# EAGLE design MuroBox-USB (EAGLE 9.6.2)

## Sheet 1 of 3
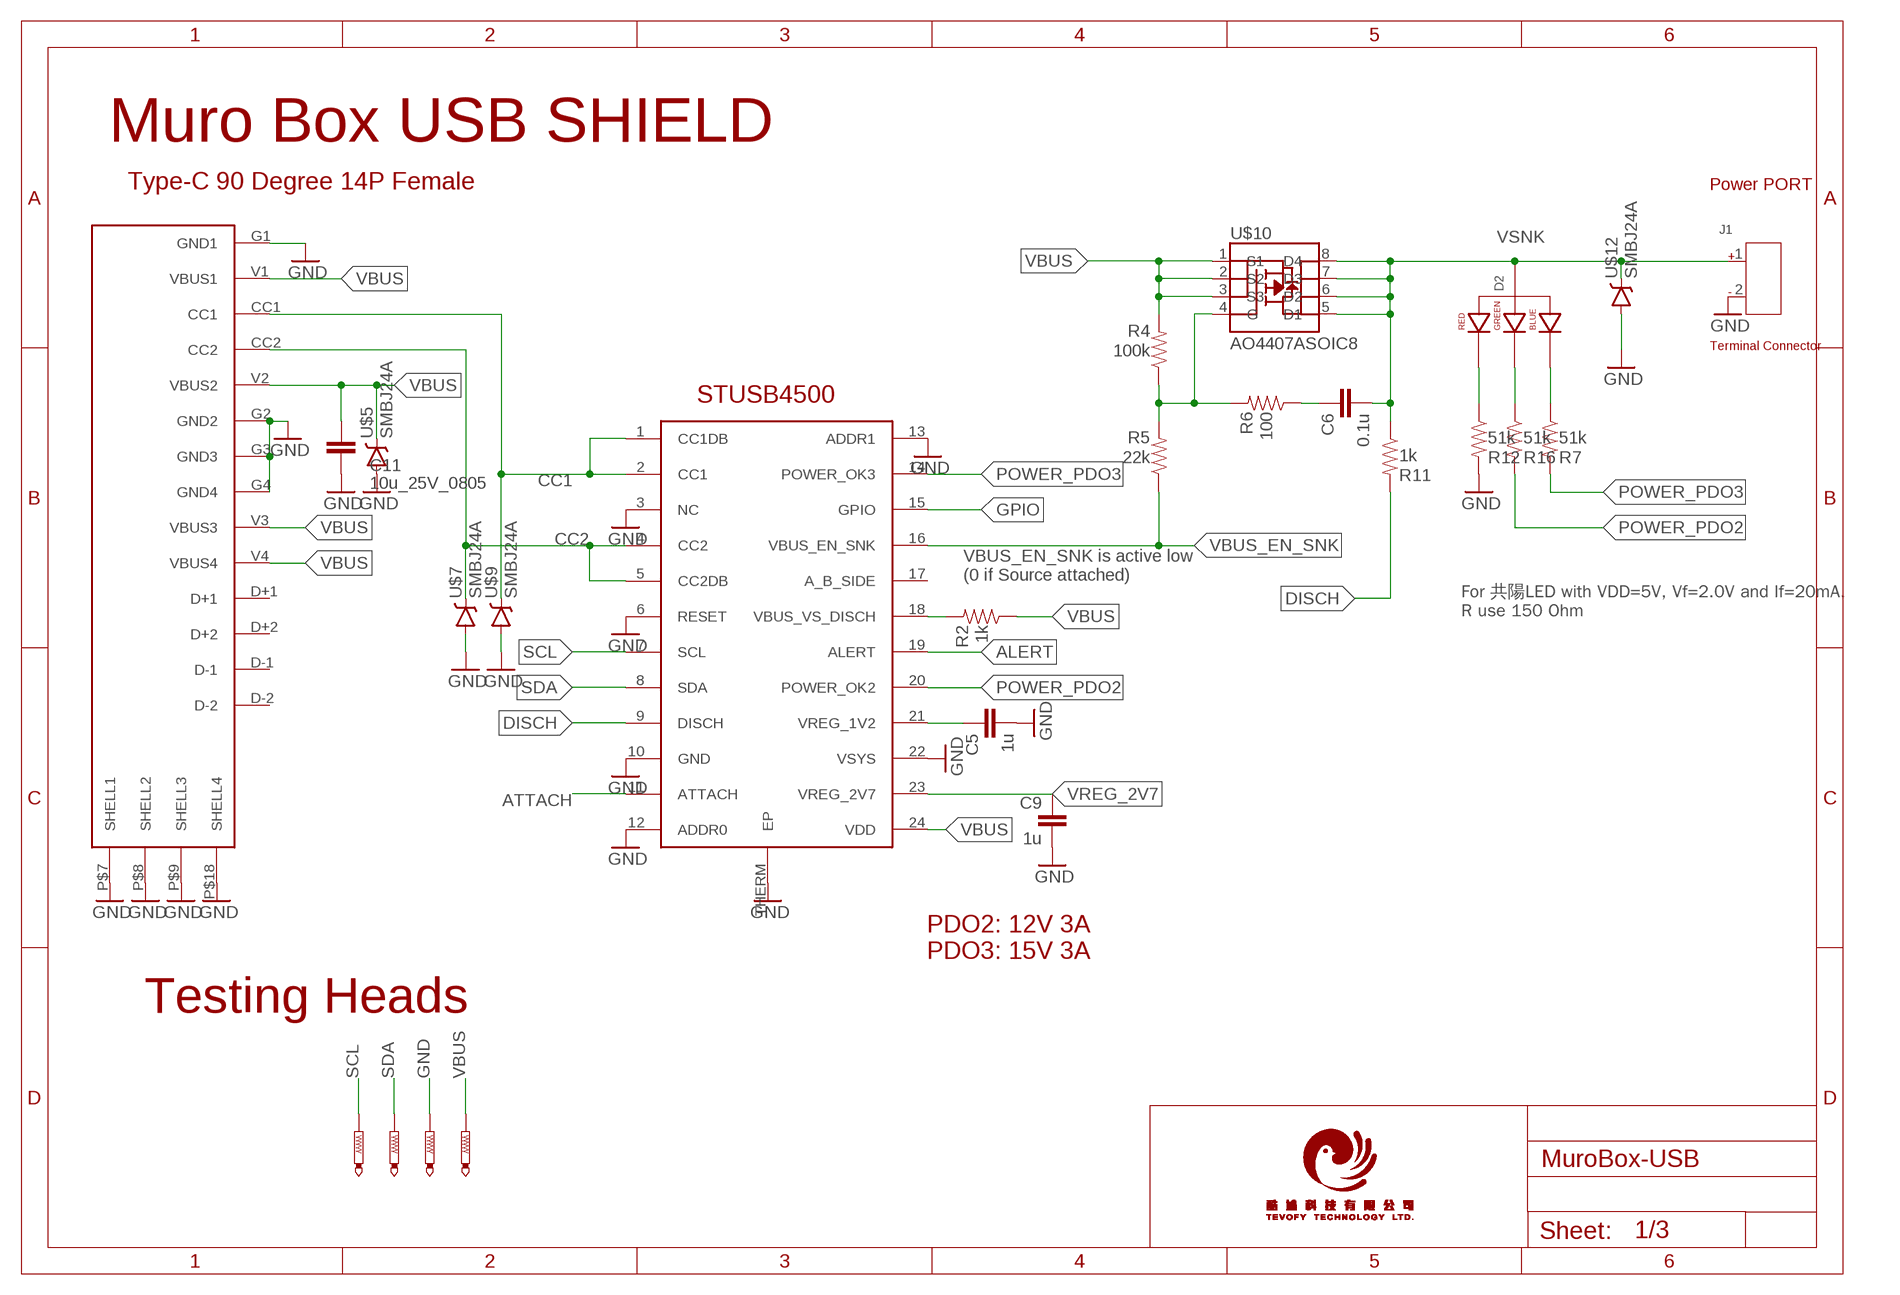
[diagram p0: schematic, sheet 1]

### Parts
C5  1u  CAP0603-CAP  [0603-CAP]
C6  0.1u  CAP0603-CAP  [0603-CAP]
C9  1u  CAP0603-CAP  [0603-CAP]
C11  10u_25V_0805  10UF10V10%(0805)  [0805-CAP]
D2  LED-RGB-CA-THRUCLEAR  [LED-RGB-THRU]
J1  DIP-SCREW-TERMINAL(2P-2.54)  [H2-2.54-5.48X6.3MM]
R2  1k  RESISTOR0603-RES  [0603-RES]
R4  100k  RESISTOR0603-RES  [0603-RES]
R5  22k  RESISTOR0603-RES  [0603-RES]
R6  100  RESISTOR0603-RES  [0603-RES]
R7  51k  RESISTOR0603-RES  [0603-RES]
R11  1k  RESISTOR0603-RES  [0603-RES]
R12  51k  RESISTOR0603-RES  [0603-RES]
R16  51k  RESISTOR0603-RES  [0603-RES]
U$1  STUSB4500  [QFN24]
U$5  SMBJ24A  [SMB-DIODE]
U$7  SMBJ24A  [SMB-DIODE]
U$9  SMBJ24A  [SMB-DIODE]
U$10  AO4407ASOIC8  [SO08]
U$12  SMBJ24A  [SMB-DIODE]
U$22  1PIN_TEST_PAD  [TP18R]
U$23  1PIN_TEST_PAD  [TP18R]
U$25  1PIN_TEST_PAD  [TP18R]
U$26  1PIN_TEST_PAD  [TP18R]
U$27  USB-TYPE-C-90D-12P  [USB-TYPE-C-90D-12P]

### Nets
ALERT: U$1.19(ALERT)
ATTACH: U$1.11(ATTACH)
CC1: U$1.1(CC1DB) U$1.2(CC1) U$9.C U$27.CC1
CC2: U$1.4(CC2) U$1.5(CC2DB) U$7.C U$27.CC2
DISCH: R11.2 U$1.9(DISCH)
GND: C5.1 C9.1 C11.1 J1.2 R12.2 U$1.3(NC) U$1.6(RESET) U$1.10(GND) U$1.12(ADDR0) U$1.13(ADDR1) U$1.22(VSYS) U$1.THERM(EP) U$5.A U$7.A U$9.A U$12.A U$26.TP U$27.G1(GND1) U$27.G2(GND2) U$27.G3(GND3) U$27.G4(GND4) U$27.P$7(SHELL1) U$27.P$8(SHELL2) U$27.P$9(SHELL3) U$27.P$18(SHELL4) ; also sheet 2,3
GPIO: U$1.15(GPIO)
N$3: D2.4(BLUE_CATHODE) R7.1
N$5: R2.2 U$1.18(VBUS_VS_DISCH)
N$8: C5.2 U$1.21(VREG_1V2)
N$9: R4.1 R5.2 R6.2 U$10.4(G)
N$10: C6.2 R6.1
N$12: D2.1(RED_CATHODE) R12.1
N$13: D2.3(GREEN_CATHODE) R16.1
POWER_PDO2: R16.2 U$1.20(POWER_OK2)
POWER_PDO3: R7.2 U$1.14(POWER_OK3)
SCL: U$1.7(SCL) U$23.TP
SDA: U$1.8(SDA) U$22.TP
VBUS: C11.2 R2.1 R4.2 U$1.24(VDD) U$5.C U$10.1(S1) U$10.2(S2) U$10.3(S3) U$25.TP U$27.V1(VBUS1) U$27.V2(VBUS2) U$27.V3(VBUS3) U$27.V4(VBUS4)
VBUS_EN_SNK: R5.1 U$1.16(VBUS_EN_SNK)
VREG_2V7: C9.2 U$1.23(VREG_2V7)
VSNK: C6.1 D2.2(ANODE) J1.1 R11.1 U$10.5(D1) U$10.6(D2) U$10.7(D3) U$10.8(D4) U$12.C
Unconnected: U$1.17(A_B_SIDE) U$27.D+1 U$27.D+2 U$27.D-1 U$27.D-2

### Notes on the sheet
- Muro Box USB SHIELD
- Type-C 90 Degree 14P Female | Power PORT
- Terminal Connector
- STUSB4500
- VBUS_EN_SNK is active low
  (0 if Source attached)
- For 共陽LED with VDD=5V, Vf=2.0V and If=20mA,
  R use 150 Ohm
- PDO2: 12V 3A
  PDO3: 15V 3A
- Testing Heads
- C:/Users/Chen-Hsiang/Hardware/EMB-COOJU/»Ź§°ӼÐ.bmp

## Sheet 2 of 3
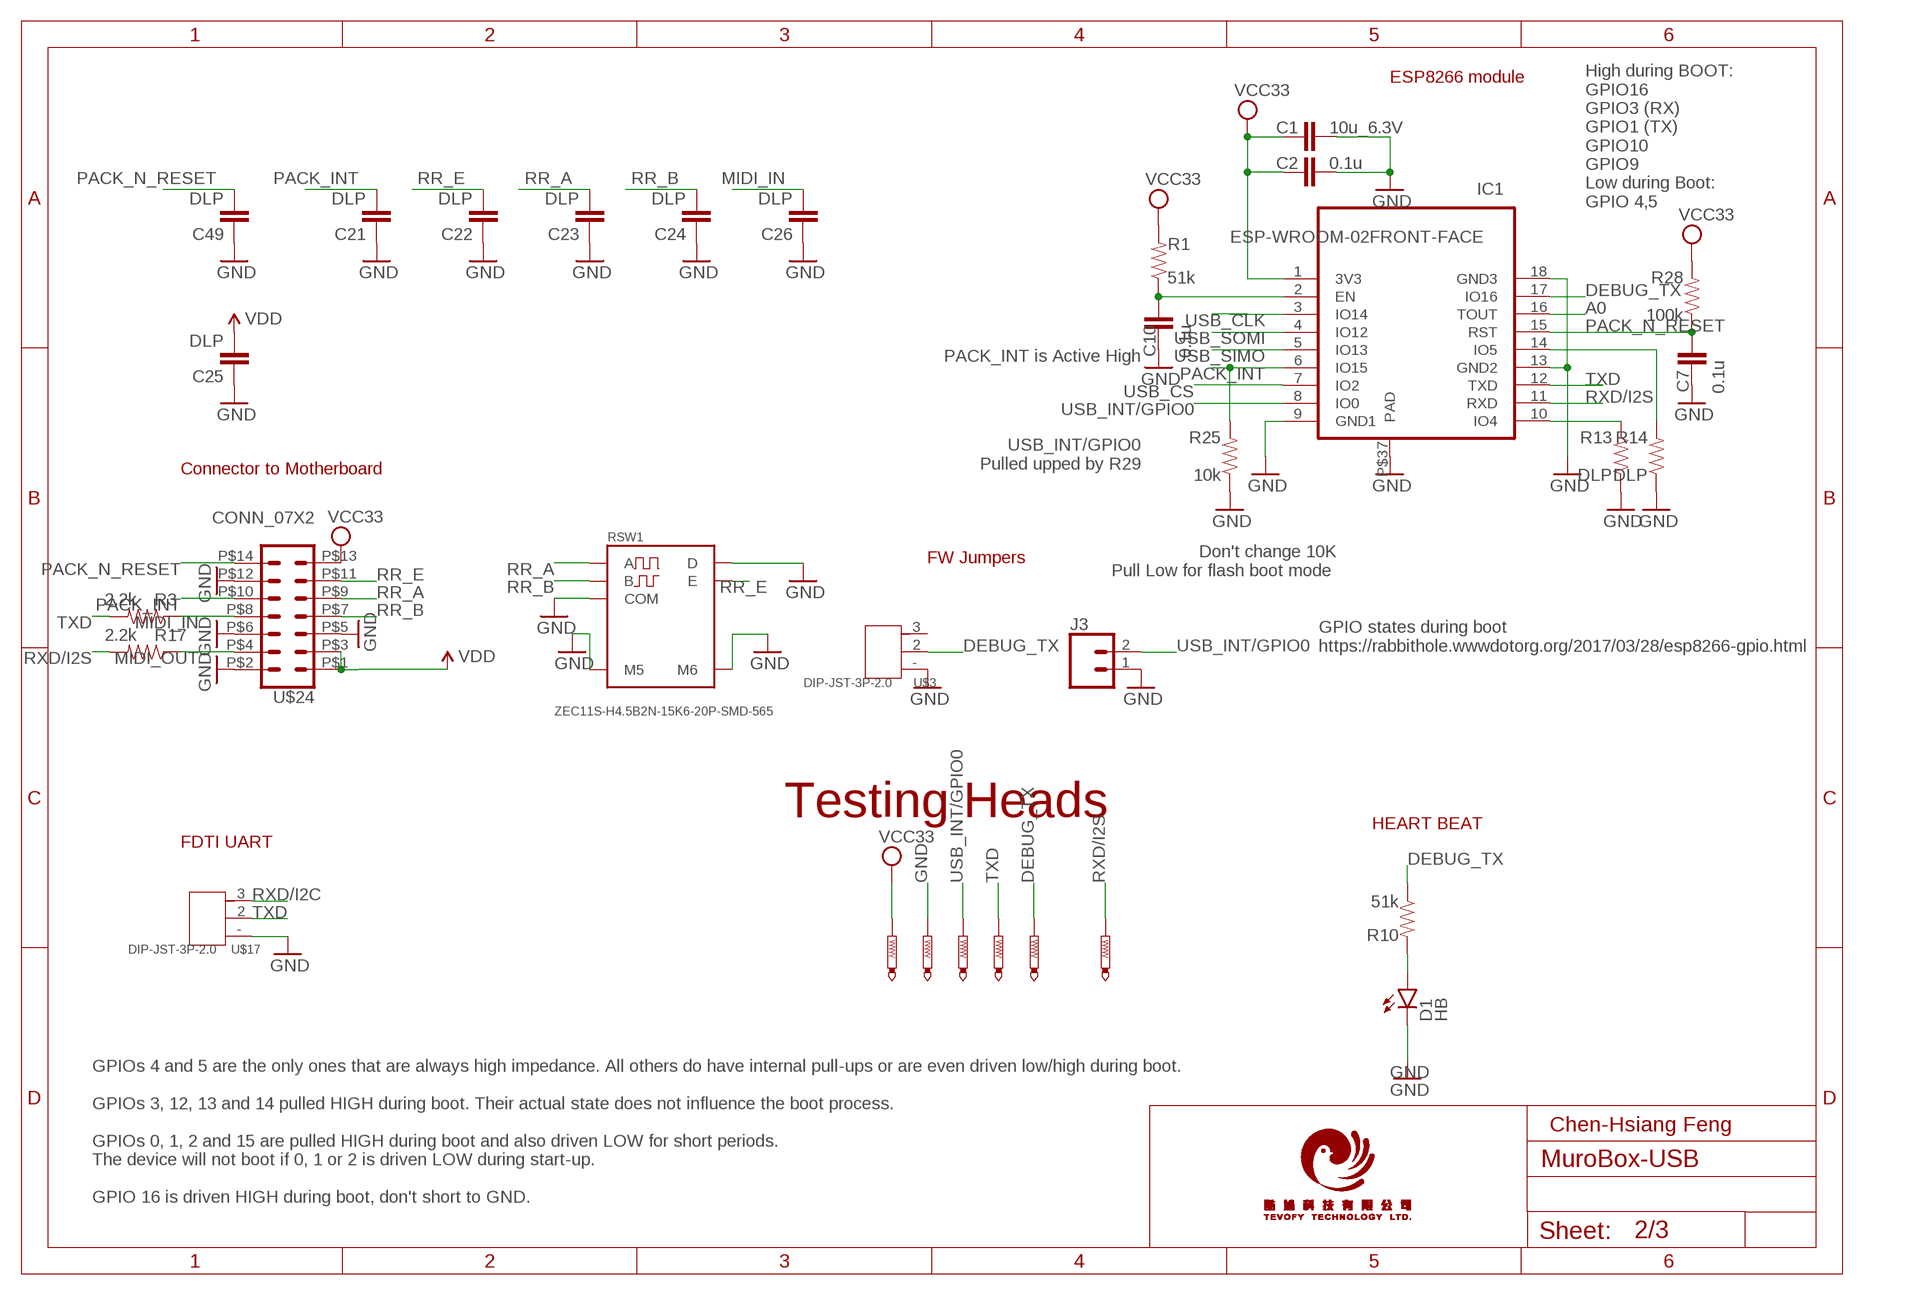
[diagram p1: schematic, sheet 2]

### Parts
C1  10u_6.3V  CAP0603-CAP  [0603-CAP]
C2  0.1u  CAP0603-CAP  [0603-CAP]
C7  0.1u  CAP0603-CAP  [0603-CAP]
C10  0.1u  CAP0603-CAP  [0603-CAP]
C21  DLP  CAP0603-CAP  [0603-CAP]
C22  DLP  CAP0603-CAP  [0603-CAP]
C23  DLP  CAP0603-CAP  [0603-CAP]
C24  DLP  CAP0603-CAP  [0603-CAP]
C25  DLP  CAP0603-CAP  [0603-CAP]
C26  DLP  CAP0603-CAP  [0603-CAP]
C49  DLP  CAP0603-CAP  [0603-CAP]
D1  HB  LED-RED0603  [LED-0603]
IC1  ESP-WROOM-02FRONT-FACE  [ESP-WROOM-02_FRONT-FACE]
J3  CONN_02LOCK  [1X02_LOCK]
R1  51k  RESISTOR0603-RES  [0603-RES]
R3  2.2k  RESISTOR0603-RES  [0603-RES]
R10  51k  RESISTOR0603-RES  [0603-RES]
R13  DLP  RESISTOR0603-RES  [0603-RES]
R14  DLP  RESISTOR0603-RES  [0603-RES]
R17  2.2k  RESISTOR0603-RES  [0603-RES]
R25  10k  RESISTOR0603-RES  [0603-RES]
R28  100k  RESISTOR0603-RES  [0603-RES]
RSW1  ZEC11S-H4.5B2N-15K6-20P-SMD-565  SW-EC11-CHINA  [EC11-CHINA]
U$3  DIP-JST-3P-2.0  [H3-2.0-8X4.5MM]
U$4  1PIN_TEST_PAD  [TP18R]
U$8  1PIN_TEST_PAD  [TP18R]
U$14  1PIN_TEST_PAD  [TP18R]
U$16  1PIN_TEST_PAD  [TP18R]
U$17  DIP-JST-3P-2.0  [H3-2.0-8X4.5MM]
U$18  1PIN_TEST_PAD  [TP18R]
U$19  1PIN_TEST_PAD  [TP18R]
U$24  CONN_07X2  [PHB-7X2]

### Nets
A0: IC1.16(TOUT)
DEBUG_TX: IC1.17(IO16) R10.1 U$3.2 U$4.TP
EN: C10.2 IC1.2(EN) R1.1
GND: C1.2 C2.2 C7.1 C10.1 C21.1 C22.1 C23.1 C24.1 C25.1 C26.1 C49.1 D1.C IC1.9(GND1) IC1.13(GND2) IC1.18(GND3) IC1.P$37(PAD) J3.1 R13.1 R14.1 R25.1 RSW1.C(COM) RSW1.M5 RSW1.M6 RSW1.SW1(D) U$3.- U$17.- U$18.TP U$24.P$2 U$24.P$5 U$24.P$6 U$24.P$12 ; also sheet 1,3
MIDI_IN: C26.2 R3.1 U$24.P$8
MIDI_OUT: R17.1 U$24.P$4
N$11: D1.A R10.2
N$14: IC1.10(IO4) R13.2
N$19: IC1.14(IO5) R14.2
PACK_INT: C21.2 IC1.6(IO15) R25.2 U$24.P$10
PACK_N_RESET: C7.2 C49.2 IC1.15(RST) R28.1 U$24.P$14 ; also sheet 3
RR_A: C23.2 RSW1.A U$24.P$9
RR_B: C24.2 RSW1.B U$24.P$7
RR_E: C22.2 RSW1.SW2(E) U$24.P$11
RXD/I2C: U$17.3
RXD/I2S: IC1.11(RXD) R17.2 U$14.TP
TXD: IC1.12(TXD) R3.2 U$8.TP U$17.2
USB_CLK: IC1.3(IO14) ; also sheet 3
USB_CS: IC1.7(IO2) ; also sheet 3
USB_INT/GPIO0: IC1.8(IO0) J3.2 U$16.TP ; also sheet 3
USB_SIMO: IC1.5(IO13) ; also sheet 3
USB_SOMI: IC1.4(IO12) ; also sheet 3
VCC: C1.1 C2.1 IC1.1(3V3) R1.2 R28.2 U$19.TP U$24.P$13 ; supply symbol labelled VCC33 ; also sheet 3
VDD: C25.2 U$24.P$1 U$24.P$3 ; also sheet 3
Unconnected: U$3.3

### Notes on the sheet
- ESP8266 module
- High during BOOT:
  GPIO16
  GPIO3 (RX)
  GPIO1 (TX)
  GPIO10
  GPIO9
  Low during Boot:
  GPIO 4,5
- PACK_INT is Active High
- USB_INT/GPIO0
  Pulled upped by R29
- Connector to Motherboard
- Don't change 10K
  Pull Low for flash boot mode
- FW Jumpers
- GPIO states during boot
  https://rabbithole.wwwdotorg.org/2017/03/28/esp8266-gpio.html
- Testing Heads
- HEART BEAT
- FDTI UART
- Chen-Hsiang Feng
- GPIOs 4 and 5 are the only ones that are always high impedance. All others do have internal pull-ups or are even driven low/high during boot.
  
  GPIOs 3, 12, 13 and 14 pulled HIGH during boot. Their actual state does not influence the boot process.
  
  GPIOs 0, 1, 2 and 15 are pulled HIGH during boot and also driven LOW for short periods. 
  The device will not boot if 0, 1 or 2 is driven LOW during start-up.
  
  GPIO 16 is driven HIGH during boot, don't short to GND.
- C:/Users/Chen-Hsiang/Hardware/EMB-COOJU/»Ź§°ӼÐ.bmp

## Sheet 3 of 3
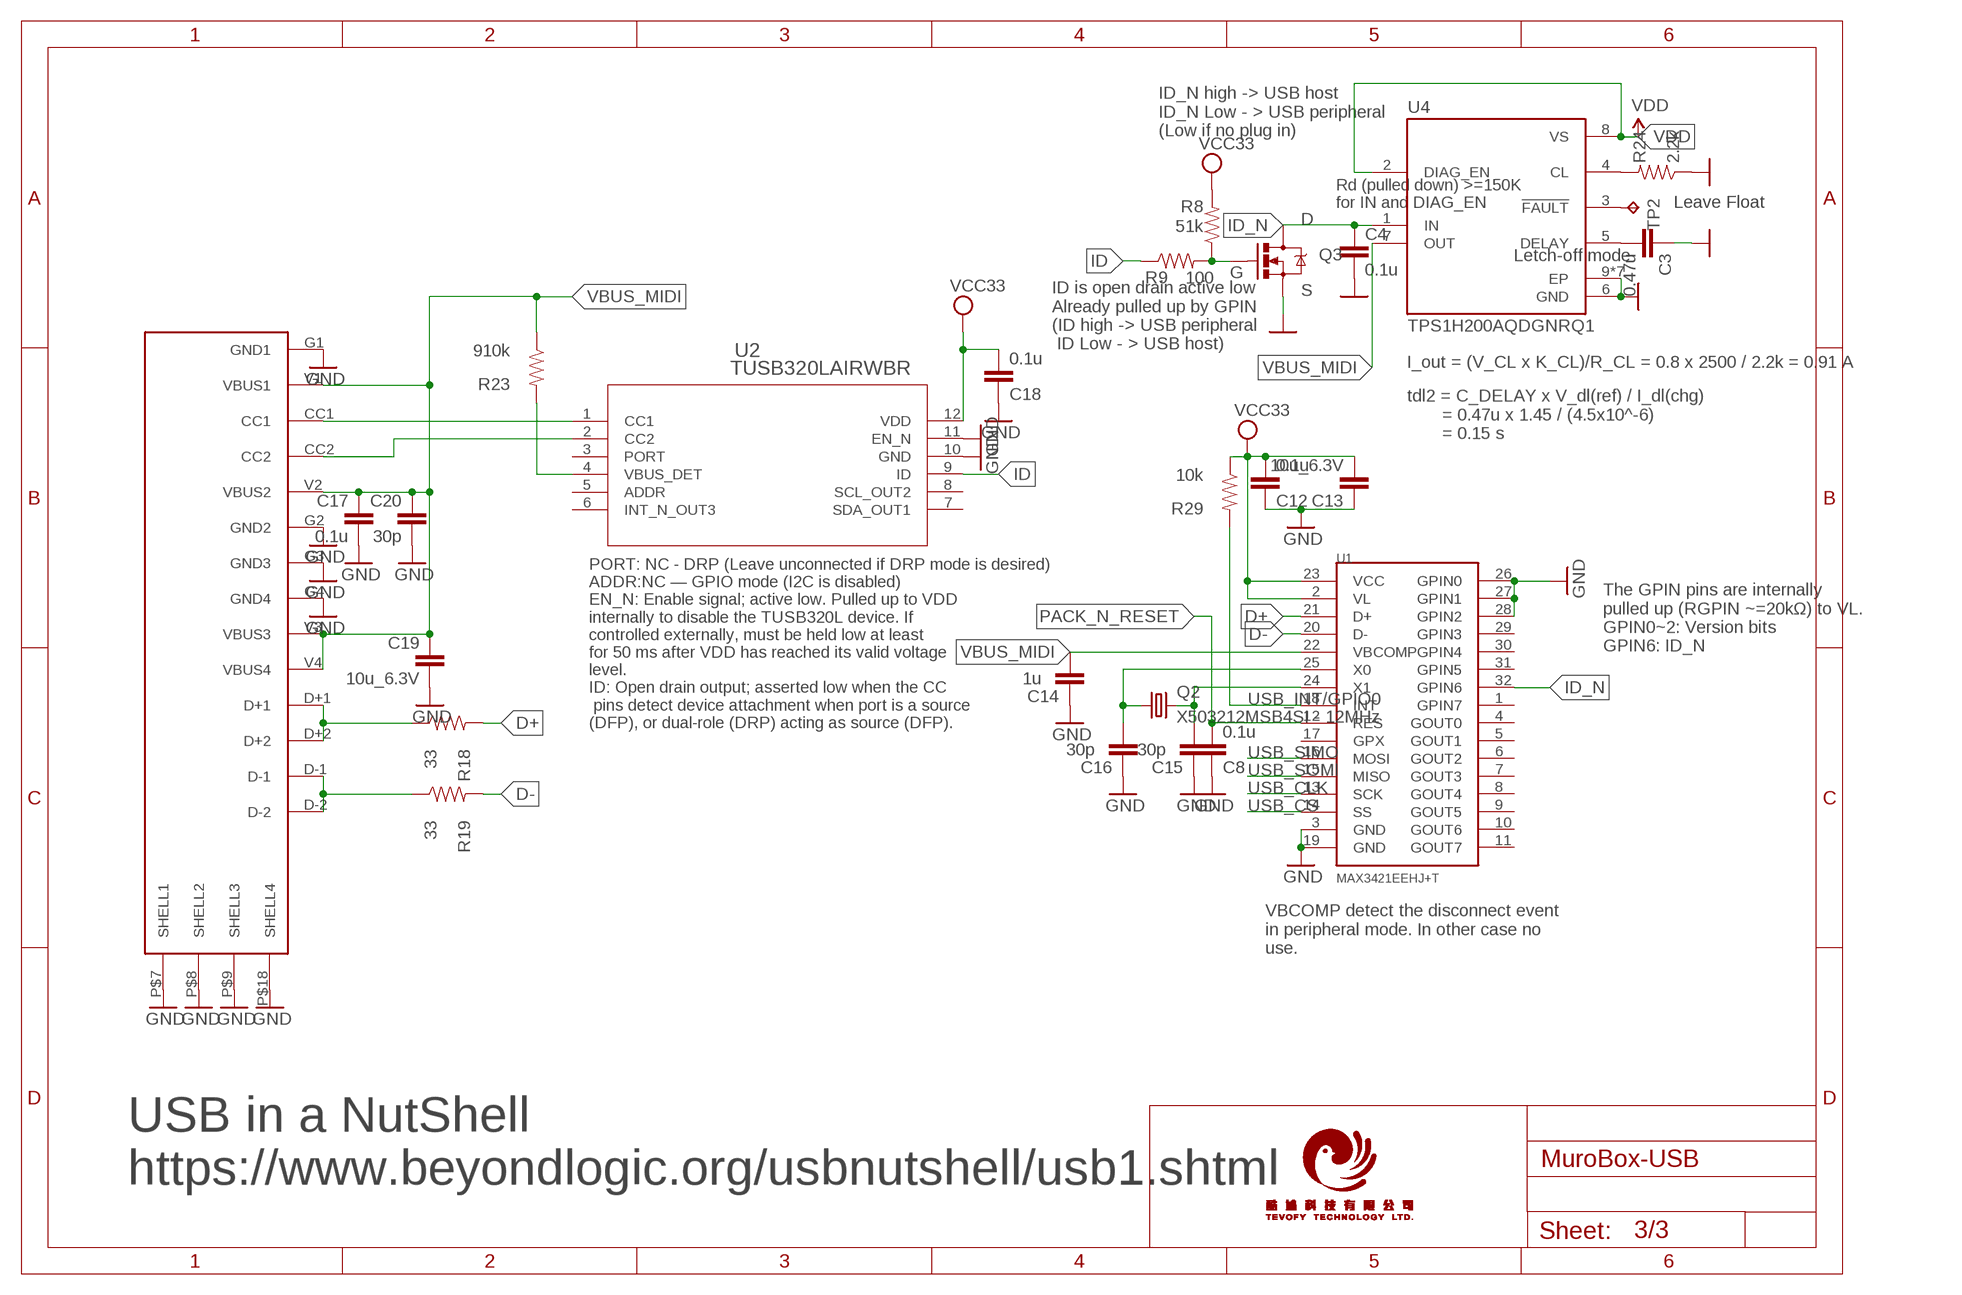
[diagram p2: schematic, sheet 3]

### Parts
C3  0.47u  CAP0603-CAP  [0603-CAP]
C4  0.1u  CAP0603-CAP  [0603-CAP]
C8  0.1u  CAP0603-CAP  [0603-CAP]
C12  0.1u  CAP0603-CAP  [0603-CAP]
C13  10u_6.3V  CAP0603-CAP  [0603-CAP]
C14  1u  CAP0603-CAP  [0603-CAP]
C15  30p  CAP0603-CAP  [0603-CAP]
C16  30p  CAP0603-CAP  [0603-CAP]
C17  0.1u  CAP0603-CAP  [0603-CAP]
C18  0.1u  CAP0603-CAP  [0603-CAP]
C19  10u_6.3V  CAP0603-CAP  [0603-CAP]
C20  30p  CAP0603-CAP  [0603-CAP]
Q2  X503212MSB4SI - 12MHz  CRYSTAL5X3  [CRYSTAL-SMD-5X3]
Q3  AO3400A_X0RB48  AO3400A_X0RB48SOT23  [SOT23]
R8  51k  RESISTOR0603-RES  [0603-RES]
R9  100  RESISTOR0603-RES  [0603-RES]
R18  33  RESISTOR0603-RES  [0603-RES]
R19  33  RESISTOR0603-RES  [0603-RES]
R23  910k  RESISTOR0603-RES  [0603-RES]
R24  2.2k  RESISTOR0603-RES  [0603-RES]
R29  10k  RESISTOR0603-RES  [0603-RES]
TP2  TPB1,27  [B1,27]
U1  MAX3421EEHJ+T  MAX3421ESMD  [TQFP32-5MM]
U2  TUSB320LAIRWBR  [RWB0012A_TEX]
U4  TPS1H200AQDGNRQ1  [SOP65P490X110-9N]
U$6  USB-TYPE-C-90D-12P  [USB-TYPE-C-90D-12P]

### Nets
D+: R18.2 U1.21(D+)
D-: R19.2 U1.20(D-)
GND: C3.1 C4.2 C8.1 C12.1 C13.1 C14.1 C15.1 C16.1 C17.1 C18.1 C19.1 C20.1 Q3.2(S) R24.1 U1.3(GND) U1.19(GND) U1.26(GPIN0) U1.27(GPIN1) U1.28(GPIN2) U2.10(GND) U2.11(EN_N) U4.6(GND) U4.9(EP) U4.9_1(EP) U4.9_2(EP) U4.9_3(EP) U4.9_4(EP) U4.9_5(EP) U4.9_6(EP) U$6.G1(GND1) U$6.G2(GND2) U$6.G3(GND3) U$6.G4(GND4) U$6.P$7(SHELL1) U$6.P$8(SHELL2) U$6.P$9(SHELL3) U$6.P$18(SHELL4) ; supply symbol labelled SUPPLY1_GND ; also sheet 1,2
ID: R9.1 U2.9(ID)
ID_N: C4.1 Q3.3(D) U1.32(GPIN6) U4.1(IN)
N$2: TP2.TP U4.3(!FAULT)
N$15: R24.2 U4.4(CL)
N$16: C3.2 U4.5(DELAY)
N$17: R18.1 U$6.D+1 U$6.D+2
N$18: R19.1 U$6.D-1 U$6.D-2
N$20: C16.2 Q2.1 U1.25(X0)
N$21: C15.2 Q2.3 U1.24(X1)
N$25: U2.1(CC1) U$6.CC1
N$26: U2.2(CC2) U$6.CC2
N$27: R23.2 U2.4(VBUS_DET)
N$28: Q3.1(G) R8.1 R9.2
PACK_N_RESET: C8.2 U1.12(RES) ; also sheet 2
USB_CLK: U1.13(SCK) ; also sheet 2
USB_CS: U1.14(SS) ; also sheet 2
USB_INT/GPIO0: R29.2 U1.18(INT) ; also sheet 2
USB_SIMO: U1.16(MOSI) ; also sheet 2
USB_SOMI: U1.15(MISO) ; also sheet 2
VBUS_MIDI: C14.2 C17.2 C19.2 C20.2 R23.1 U1.22(VBCOMP) U4.7(OUT) U$6.V1(VBUS1) U$6.V2(VBUS2) U$6.V3(VBUS3) U$6.V4(VBUS4)
VCC: C12.2 C13.2 C18.2 R8.2 R29.1 U1.2(VL) U1.23(VCC) U2.12(VDD) ; supply symbol labelled VCC33 ; also sheet 2
VDD: U4.2(DIAG_EN) U4.8(VS) ; also sheet 2
Unconnected: U1.1(GPIN7) U1.4(GOUT0) U1.5(GOUT1) U1.6(GOUT2) U1.7(GOUT3) U1.8(GOUT4) U1.9(GOUT5) U1.10(GOUT6) U1.11(GOUT7) U1.17(GPX) U1.29(GPIN3) U1.30(GPIN4) U1.31(GPIN5) U2.3(PORT) U2.5(ADDR) U2.6(INT_N_OUT3) U2.7(SDA_OUT1) U2.8(SCL_OUT2)

### Notes on the sheet
- ID_N high -> USB host
  ID_N Low - > USB peripheral
  (Low if no plug in)
- Rd (pulled down) >=150K
  for IN and DIAG_EN
- Leave Float
- D
- Letch-off mode
- G
- S
- ID is open drain active low
  Already pulled up by GPIN
  (ID high -> USB peripheral
   ID Low - > USB host)
- I_out = (V_CL x K_CL)/R_CL = 0.8 x 2500 / 2.2k = 0.91 A
- tdl2 = C_DELAY x V_dl(ref) / I_dl(chg)
         = 0.47u x 1.45 / (4.5x10^-6)
         = 0.15 s
- The GPIN pins are internally
  pulled up (RGPIN ~=20kΩ) to VL.
  GPIN0~2: Version bits
  GPIN6: ID_N
- PORT: NC - DRP (Leave unconnected if DRP mode is desired)
  ADDR:NC — GPIO mode (I2C is disabled)
  EN_N: Enable signal; active low. Pulled up to VDD
  internally to disable the TUSB320L device. If 
  controlled externally, must be held low at least 
  for 50 ms after VDD has reached its valid voltage
  level.
  ID: Open drain output; asserted low when the CC
   pins detect device attachment when port is a source 
  (DFP), or dual-role (DRP) acting as source (DFP).
- VBCOMP detect the disconnect event
  in peripheral mode. In other case no
  use.
- USB in a NutShell
  https://www.beyondlogic.org/usbnutshell/usb1.shtml
- C:/Users/Chen-Hsiang/Hardware/EMB-COOJU/»Ź§°ӼÐ.bmp

## Library data of the parts
C1-C10 C12-C26 C49 = SparkFun-Passives:CAP: Capacitor Standard 0603 ceramic capacitor, and 0.1" leaded capacitor.
C11 = SparkFun-Capacitors:10UF10V10%(0805): CAP-11330; PROD_ID: CAP-11330
D1 = SparkFun-LED:LED-RED: Assorted Red LEDs LilyPad 1206- DIO-09912 1206- DIO-00809 0603- DIO-00819 "SMART" means more efficient and expensive; PROD_ID: DIO-00819; VALUE: RED
D2 = SparkFun-LED:LED-RGB-CA-THRU: RGB Through-hole common anode SparkFun store front COM-10821 (diffuse) COM-10820 (clear); PROD_ID: DIO-10631
IC1 = music_box:ESP-WROOM-02: WiFi module - ESP-WROOM-02; PART_NUMBER: ESP-WROOM-02; SUPPLIER: espressif
J1 = music_box:DIP-SCREW-TERMINAL(2P-2.54): 320110133
J3 = SparkFun-Connectors:CONN_02: Multi connection point. Often used as Generic Header-pin footprint for 0.1 inch spaced/style header connections On any of the 0.1 inch spaced packages, you can populate with these: Break Away Headers - Straight <https://www.sparkfun.com/products/116> (PRT-00116) Break Away Male Headers - Right Angle <https://www.sparkfun.com/products/553> (PRT-00553) Female Headers <https://www.sparkfun.com/products/115> (PRT-00115) Break Away Headers - Machine Pin <https://www.sparkfun.com/products/117> (PRT-00117) Break Away Female Headers - Swiss Machine Pin <https://www.sparkfun.com/products/743> (PRT-00743) For SCREWTERMINALS and SPRING TERMINALS visit here: Screw Terimnals on SparkFun.com <https://www.sparkfun.com/search/results?term=Screw+Terminals> (5mm/3.5mm/2.54mm spacing) This device is also useful as a general connection point to wire up your design to another part of your project. Our various solder wires solder well into these plated through hole pads. Hook-Up Wire - Assortment (Stranded, 22 AWG) <https://www.sparkfun.com/products/11375> (PRT-11375) Hook-Up Wire - Assortment (Solid Core, 22 AWG) <https://www.sparkfun.com/products/11367> (PRT-11367) View the entire wire category on our website here <https://www.sparkfun.com/categories/141> Special notes: Molex polarized connector foot print use with: PRT-08233 with associated crimp pins and housings. 2.54_SCREWTERM for use with PRT-10571. 3.5mm Screw Terminal footprints for PRT-08084 5mm Screw Terminal footprints for use with PRT-08432
Q2 = USBHostShield-v13:CRYSTAL: Crystals Various standard crystals. Proven footprints. Spark Fun Electronics SKU : COM-00534
Q3 = music_box:AO3400A_X0RB48: MOSFET
R1-R14 R16-R19 R23-R25 R28 R29 = SparkFun-Passives:RESISTOR: Resistor Basic schematic elements and footprints for 0603, 1206, and PTH resistors.
RSW1 = music_box:SW-EC11-CHINA: 大陸廠排 https://detail.1688.com/offer/530151855898.html?spm=a2615.7691456.autotrace-offerGeneral.13.40d64726QFa8QW
TP2 = testpad:TP: Test pad
U1 = USBHostShield-v13:MAX3421E: USB Peripheral/Host Controller w/ SPI
U2 = TUSB320LAIRWBR:TUSB320LAIRWBR; BUILT_BY: EMA_UL_Team; COPYRIGHT: Copyright (C) 2018 Accelerated Designs. All rights reserved; MANUFACTURER_PART_NUMBER: TUSB320LAIRWBR; SOURCELIBRARY: TI_2019-03-28; VENDOR: Texas Instruments
U4 = TPS1H200AQDGNRQ1:TPS1H200AQDGNRQ1: Power Switch/Driver 1:1 N-Channel 2.5A 8-MSOP-PowerPad; AVAILABILITY: Unavailable; DESCRIPTION: Power Switch/Driver 1:1 N-Channel 2.5A 8-MSOP-PowerPad; MF: Texas Instruments; MP: TPS1H200AQDGNRQ1; PACKAGE: MSOP-8 Texas Instruments; PRICE: None
U$1 = music_box:STUSB4500: STUSB4500： Standalone USB PD sink controller with short-to-VBUS protections
U$3 U$17 = music_box:DIP-JST-3P-2.0
U$4 U$8 U$14 U$16 U$18 U$19 U$22 U$23 U$25 U$26 = music_box:1PIN_TEST_PAD
U$5 U$7 U$9 U$12 = music_box:SMBJ24A: TVS贴片瞬态抑制二极管 SMBJ12A-E3/52 600W 12V ==== https://item.taobao.com/item.htm?spm=a1z0d.7625083.1998302264.5.686c4e69JiVgEf&id=522552831489
U$6 U$27 = music_box:USB-TYPE-C-90D-12P: USB type-c 12p 直立式 smd 淘寶買的 https://item.taobao.com/item.htm?spm=a1z09.2.0.0.2abf2e8d68dfN7&id=554675207939&_u=72nkl8u2d455
U$10 = music_box:AO4407A: AO4407A 30V P-Channel MOSFET
U$24 = music_box:CONN_07X2

## Board
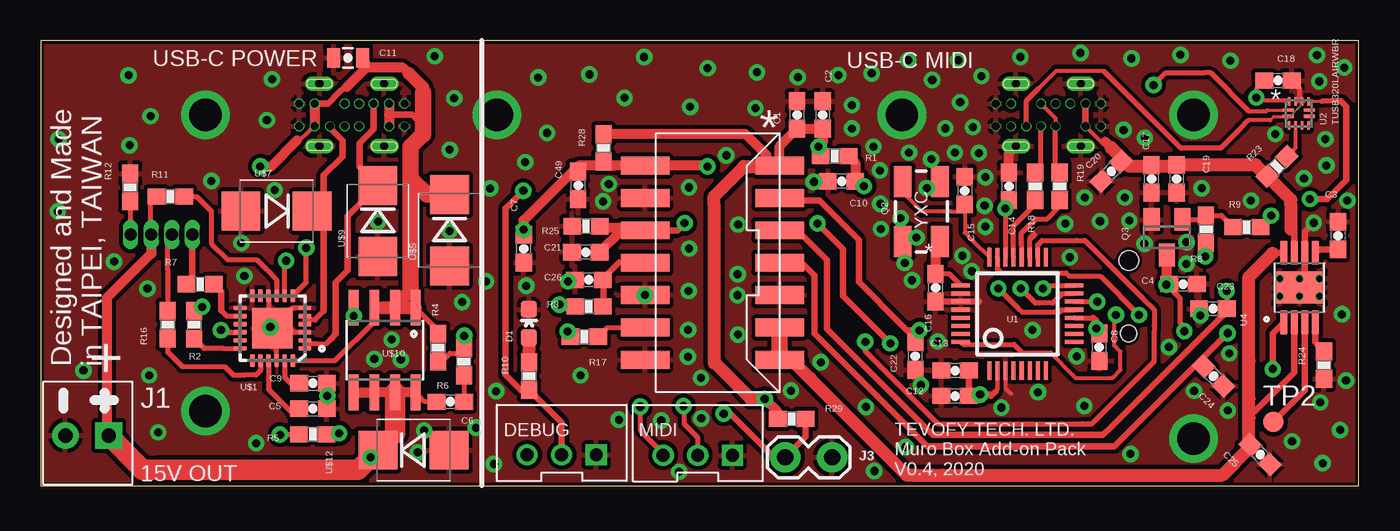
[diagram p3: board, top side]
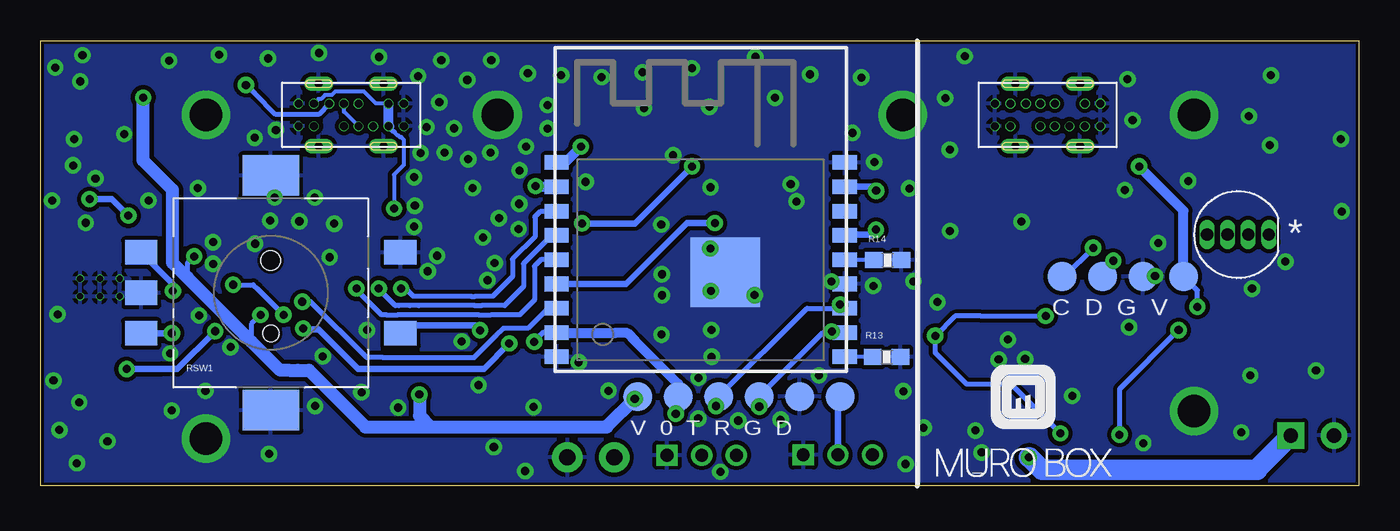
[diagram p4: board, bottom side, seen from below]

Size 81.4 x 27.5 mm. Coordinates in mm from the lower left corner, seen from the top.
Outline: 0,0 81.4,0
Outline: 0,27.5 0,0
Outline: 81.4,27.5 0,27.5
Outline: 81.4,0 81.4,27.5
Outline: 0,27.5 0,0
Outline: 0,0 81.4,0
Outline: 81.4,27.5 0,27.5
Outline: 81.4,0 81.4,27.5
Copper layers (1*16): Top 0.035mm / dielectric 1.5mm / Bottom 0.035mm
Design rules "SparkFun-2-layer *": minimum track width 10mil, minimum drill 20mil, track to track 10mil, track to pad 8mil, pad to pad 8mil, via to via 10mil, smd to smd 8mil, copper to edge 8mil, drill to drill 8mil, minimum pad ring 1mil, minimum via ring 10mil, stop-mask expansion 4mil, vias tented up to drill 20mil, thermal gap 10mil

### Footprints (pad centres in the part's own frame; a part is rotated, then mirrored left to right if it is on the bottom)
0603-CAP = smd 1.1 x 1: 1 -0.85,0; 2 0.85,0
0805-CAP = smd 0.8 x 1.2: 1 -0.9,0; 2 0.9,0
LED-0603 = smd 1 x 1: A 0,-0.877; C 0,0.877
LED-RGB-THRU = drill 0.762 pad 0.889 long: 1 1.905,0; 2 0.635,0; 3 -0.635,0; 4 -1.905,0
ESP-WROOM-02_FRONT-FACE = smd 1.485 x 0.9: 1 -8.893,4.9; 2 -8.893,3.4; 3 -8.893,1.9; 4 -8.893,0.4; 5 -8.893,-1.1; 6 -8.893,-2.6; 7 -8.893,-4.1; 8 -8.893,-5.6; 9 -8.893,-7.1; 10 8.893,-7.1; 11 8.893,-5.6; 12 8.893,-4.1; 13 8.893,-2.6; 14 8.893,-1.1; 15 8.893,0.4; 16 8.893,1.9; 17 8.893,3.4; 18 8.893,4.9 | smd 4.3 x 4.3: P$37 1.524,-1.878
H2-2.54-5.48X6.3MM = drill 0.889 pad 1.651 square: 1 3.3,4.064 | drill 0.889 pad 1.651: 2 3.3,1.397
1X02_LOCK = drill 1.016 pad 1.88: 1 -0.178,0; 2 2.718,0
CRYSTAL-SMD-5X3 = smd 1.9 x 1.1: 1 -1.85,-1.15; 2 1.85,-1.15; 3 1.85,1.15; 4 -1.85,1.15
SOT23 = smd 1 x 1.4: 1 -0.95,-1.1; 2 0.95,-1.1; 3 0,1.1
0603-RES = smd 1.1 x 1: 1 -0.85,0; 2 0.85,0
EC11-CHINA = smd 1.5 x 2: A -2.5,-8; B 2.5,-8; C 0,-8; SW1 -2.5,8; SW2 2.5,8 | smd 2.5 x 3.5: M5 -7.25,0; M6 7.25,0 | hole 1.2: -2,0 | hole 1: 2.5,0
B1,27 = smd 1.27 x 1.27: TP 0,0
TQFP32-5MM = smd 1.143 x 0.254: 1 -3.5,1.75; 2 -3.5,1.25; 3 -3.5,0.75; 4 -3.5,0.25; 5 -3.5,-0.25; 6 -3.5,-0.75; 7 -3.5,-1.25; 8 -3.5,-1.75; 17 3.5,-1.75; 18 3.5,-1.25; 19 3.5,-0.75; 20 3.5,-0.25; 21 3.5,0.25; 22 3.5,0.75; 23 3.5,1.25; 24 3.5,1.75 | smd 0.254 x 1.143: 9 -1.75,-3.5; 10 -1.25,-3.5; 11 -0.75,-3.5; 12 -0.25,-3.5; 13 0.25,-3.5; 14 0.75,-3.5; 15 1.25,-3.5; 16 1.75,-3.5; 25 1.75,3.5; 26 1.25,3.5; 27 0.75,3.5; 28 0.25,3.5; 29 -0.25,3.5; 30 -0.75,3.5; 31 -1.25,3.5; 32 -1.75,3.5
RWB0012A_TEX = smd 0.711 x 0.203: 1 -0.65,0.2; 2 -0.65,-0.2; 7 0.65,-0.2; 8 0.65,0.2 | smd 0.203 x 0.508: 3 -0.6,-0.75; 4 -0.2,-0.75; 5 0.2,-0.75; 6 0.6,-0.75; 9 0.6,0.75; 10 0.2,0.75; 11 -0.2,0.75; 12 -0.6,0.75
SOP65P490X110-9N = smd 1.47 x 0.48: 1 -2.15,0.975; 2 -2.15,0.325; 3 -2.15,-0.325; 4 -2.15,-0.975; 5 2.15,-0.975; 6 2.15,-0.325; 7 2.15,0.325; 8 2.15,0.975 | smd 2 x 3: 9 0,0 | drill 0.4 pad 0.3: 9_1 0.55,0; 9_2 -0.55,0; 9_3 -0.55,-1.22; 9_4 0.55,-1.22; 9_5 0.55,1.22; 9_6 -0.55,1.22
QFN24 = smd 0.8 x 0.28: 1 -2,1.25; 2 -2,0.75; 3 -2,0.25; 4 -2,-0.25; 5 -2,-0.75; 6 -2,-1.25; 13 2,-1.25; 14 2,-0.75; 15 2,-0.25; 16 2,0.25; 17 2,0.75; 18 2,1.25 | smd 0.28 x 0.8: 7 -1.25,-2; 8 -0.75,-2; 9 -0.25,-2; 10 0.25,-2; 11 0.75,-2; 12 1.25,-2; 19 1.25,2; 20 0.75,2; 21 0.25,2; 22 -0.25,2; 23 -0.75,2; 24 -1.25,2 | smd 2.5 x 2.5: THERM 0,0
H3-2.0-8X4.5MM = drill 0.8 pad 1.3: 2 0,0.75; 3 2.132,0.75 | drill 0.8 pad 1.3 square: - -2.132,0.75
TP18R = smd 1.8 x 1.8: TP 0,0
SMB-DIODE = smd 2.4 x 2.4: A 2.2,0; C -2.2,0
USB-TYPE-C-90D-12P = drill 0.5 pad 0.6: CC1 -1.35,0.7; CC2 1.35,-0.7; D+1 -0.45,0.7; D+2 0.45,-0.7; D-1 0.45,0.7; D-2 -0.45,-0.7; G1 -3.25,0.7; G2 -3.25,-0.7; G3 3.25,0.7; G4 3.25,-0.7; V1 -2.3,0.7; V2 -2.3,-0.7; V3 2.3,0.7; V4 2.3,-0.7 | drill 0.5 pad 0.9 long: P$7 2,-1.93; P$8 -2,1.93; P$9 -2,-1.93; P$18 2,1.93
SO08 = smd 0.61 x 2.21: 1 -1.905,-2.616; 2 -0.635,-2.616; 3 0.635,-2.616; 4 1.905,-2.616; 5 1.905,2.616; 6 0.635,2.616; 7 -0.635,2.616; 8 -1.905,2.616
PHB-7X2 = smd 1.1 x 3: P$1 -12,0; P$2 -12,8.3; P$3 -10,0; P$4 -10,8.3; P$5 -8,0; P$6 -8,8.3; P$7 -6,0; P$8 -6,8.3; P$9 -4,0; P$10 -4,8.3; P$11 -2,0; P$12 -2,8.3; P$13 0,0; P$14 0,8.3

### Placement (x,y rotation side)
C1  46.7,22.9 90 top
C2  48.29,22.91 90 top
C3  80.11,15.45 270 top
C4  70.54,12.45 0 top
C5  16.83,4.75 180 top
C6  25.3,5.18 0 top
C7  29.84,14.64 90 top
C8  65.37,8.56 90 top
C9  16.83,6.33 180 top
C10  49.45,18.8 0 top
C11  18.98,26.43 0 top
C12  56.46,5.54 0 top
C13  56.46,7.12 0 top
C14  59.79,18.49 270 top
C15  57.06,18.23 270 top
C16  55.26,12.23 90 top
C17  68.58,18.96 90 top
C18  76.4,25.02 180 top
C19  70.14,18.96 90 top
C20  66.11,19.41 45 top
C21  33.67,14.42 0 top
C22  54.01,8.01 90 top
C23  72.38,10.93 0 top
C24  72.42,6.77 135 top
C25  75.3,1.92 135 top
C26  33.86,12.71 0 top
C49  33.19,18.55 90 top
D1  30.15,10.02 0 top
D2  7.47,15.51 0 bottom
IC1  40.64,15.06 0 bottom
J1  0.15,6.4 270 top
J3  48.69,1.75 180 top
Q2  54.38,16.93 90 top
Q3  69.54,15.35 180 top
R1  49.02,20.36 180 top
R2  9.49,9.93 270 top
R3  33.86,11.07 180 top
R4  24.55,8.52 90 top
R5  16.8,3.17 0 top
R6  26.14,7.67 90 top
R7  9.86,12.44 0 top
R8  71.95,15.84 270 top
R9  74.47,15.97 180 top
R10  30.16,6.77 90 top
R11  8.02,17.85 0 top
R12  5.54,18.43 90 top
R13  29.17,7.95 180 bottom
R14  29.1,13.93 180 bottom
R16  7.85,9.95 270 top
R17  33.57,9.2 180 top
R18  61.4,18.5 270 top
R19  62.91,18.5 270 top
R23  76.33,19.72 45 top
R24  79.24,7.45 90 top
R25  33.68,16.03 0 top
R28  34.76,20.87 90 top
R29  46.37,4.13 0 top
RSW1  67.18,11.91 270 bottom
TP2  76.11,3.93 0 top
U1  60.32,10.62 90 top
U2  77.68,23 0 top
U4  77.73,12.24 90 top
U$1  14.33,9.73 180 top
U$3  32.18,2.65 180 top
U$4  32.04,5.5 90 bottom
U$5  25.26,15.77 270 top
U$6  62.22,22.9 0 bottom
U$7  14.57,16.96 180 top
U$8  39.54,5.5 270 bottom
U$9  20.83,16.34 270 top
U$10  21.25,8.37 180 top
U$12  23.03,2.2 0 top
U$14  37.04,5.5 180 bottom
U$16  42.04,5.5 270 bottom
U$17  40.58,2.64 180 top
U$18  34.54,5.5 270 bottom
U$19  44.54,5.5 270 bottom
U$22  15.84,12.92 0 bottom
U$23  18.34,12.92 0 bottom
U$24  45.63,19.77 90 top
U$25  10.84,12.92 0 bottom
U$26  13.34,12.92 0 bottom
U$27  19.22,22.9 0 bottom

### Tracks (layer width: path | path; a pad name or v marks a point on that pad's centre or on a via)
A0
  Bottom 0.61: 31.72,16.99 IC1.16
CC1
  Top 0.305: U$1.1 U$1.2 16.53,8.77 17.11,8.77 17.63,8.77 17.91,9.04
  Top 0.406: U$27.CC1 20.57,22.03 19.7,21.16 19.7,19.68 U$9.C 18.95,16.67 18.95,13.29 18.22,12.56 18.22,9.36 17.91,9.04
CC2
  Top 0.305: U$1.4 U$1.5 16.57,10.23 16.97,10.23 16.97,10.27 17.48,10.78
  Top 0.406: 17.48,10.78 17.48,17.13 | 17.48,17.13 17.48,18.78 17.48,19.18 18.64,20.34 18.64,21.3 17.87,22.07 U$27.CC2 | U$7.C 16.94,17.13 17.48,17.13
D+
  Top 0.305: U1.21 60.07,16.03 61.4,17.36 R18.2
D-
  Top 0.305: U1.20 60.57,14.83 60.57,15.02 60.57,15.61 61.05,16.09 61.44,16.48 62.16,16.48 62.91,17.23 R19.2 62.91,17.36
DEBUG_TX  (via drill 0.5)
  Top 0.406: U$3.2 32.18,3.9 R10.1 29.64,5.92 28.72,6.84 28.72,17.06 28.72,17.16 28.75,17.16 v29.81,18.22
  Bottom 0.305: U$4.TP 32.04,5.08 32.27,4.85
  Bottom 0.406: 32.18,1.92 U$3.2 32.18,4.76 32.27,4.85 | IC1.17 30.37,18.46 30.02,18.46 29.81,18.25 v29.81,18.22
DISCH
  Top 0.305: U$1.9 14.58,12.71 13.92,13.37 13.33,13.96 11.55,13.96 10.54,14.97 10.54,16.97 9.66,17.85 R11.2
EN  (via drill 0.5)
  Top 0.61: R1.1 49.89,20.34 50.3,19.93 C10.2 50.59,18.51 v50.84,18.51
  Bottom 0.61: 49.56,18.44 IC1.2 | 49.61,18.39 IC1.2 | v50.84,18.51 50.79,18.46 IC1.2
GND  (via drill 0.5, 2)
  Top 0.2: U2.11 U2.10
  Top 0.254: U1.3 59.57,6.02 59.91,5.68
  Top 0.305: U$1.6 15.55,10.97 15.42,10.84 15.24,10.84 v14.2,9.79 14.08,9.91 14.08,9.97 U$1.10 | U$1.3 14.58,9.47 | 14.58,9.47 U$1.THERM | U$1.22 14.58,9.47 | 14.58,9.47 U$1.THERM | 15.54,9.56 14.41,9.56 | 14.27,9.79 14.44,9.62 14.42,9.62 | 14.42,9.62 14.31,9.73 14.31,9.82 14.49,10 14.56,10 14.59,10.03 | U$1.THERM 14.33,9.7 14.51,9.52 | U$1.THERM 14.45,9.72 14.65,9.52 14.56,9.52 | 14.51,9.86 14.54,9.89 14.44,9.89 14.43,9.88 14.44,9.88 14.47,9.91 | 13.91,10.08 14.08,9.91 14.14,9.91 U$1.THERM | U$1.THERM 14.33,9.71 14.42,9.62 | 61.07,14.1 61.07,15.22 | 61.07,15.22 61.36,15.51 61.07,15.22 | C16.1 | U1.19 61.07,15.22 | C18.1 77.72,24.55 77.72,24.42 77.72,23.91 U2.10
  Top 0.406: C16.1 57.93,11.37 U1.27 | 78.05,12.61 78.05,14.43 78.05,15.69 v78.61,16.24
  Top 0.61: C14.1 59.79,20.54 U$6.P$7
  Bottom 0.406: v12.59,12.96 13.09,12.96 U$26.TP
  other vias: 10.55,18.82 21.67,9.03 14.46,18.26 17.71,5.54 23.69,3.41 25.24,15.73 10.18,4.61 20.61,7.82 22.24,7.79 78.81,26.59 57.49,13.24 4.55,13.84 29.99,12.34 44.15,23.32 80.6,6.49 55.4,8.91 37.32,11.77 73.4,8.17 67.23,16.37 40.78,6.66 51.85,17.41 54.72,18.38 5.5,21.03 24.34,26.53 54.36,6.21 54.09,15.33 59.33,4.82 39.99,9.62 79.16,1.39 29.93,19.99 35.09,18.63 28.14,5.83 5.44,25.35 71.18,2.91 71.18,22.9 20.83,16.31 10.18,22.9 25.54,23.94 30.73,25.21 34.73,17.56 32.57,12.61 43.08,16.13 43.03,11.76 42.35,20.4 33.35,6.81 64.47,17.8 58.34,19.05 38.33,4.02 77.27,2.74 37.27,26.48 63.55,14.11 79.39,19.78 46.76,25.23 40.04,18.43 40.05,14.65 63.98,7.99 69.67,8.56 28.18,22.9 53.18,22.9 36.06,23.96 12.4,14.99 71.62,10.51 48.18,7.62 53.42,2.38 46.34,5.86 51.89,15.85 53.1,16.52 50.1,23.5 58.34,16 55,20.16 51.83,19.47 50.1,22.06 55.87,22.07 49.26,25.36 51.32,25.47 67.36,26.39 41.19,25.79 64.21,26.73 60.5,26.48 58.09,25.29 57.57,22.15 55.05,25.06 53.81,12.69 58.29,17.29 57.94,20.55 56.78,23.68 53.63,20.57 61.25,9.61 56.46,20.57 71.22,5.85 78.95,24.97 78.01,18.98 79.33,21.41 73.47,26.25 80.35,10.58 63.27,16.18 65.42,16.33 66.95,17.8 74.73,17.61 71.69,18.37 68.18,21.49 66.87,21.97 31.28,21.79 64.45,4.92 1.07,16.94 1.12,21.41 2.66,7.11 7.27,3.29 14.3,25.11 40.02,12.03 43.06,9.33 27.51,12.62 70.75,15.04 56.92,14.2 51.43,20.94 73.31,4.64 80.24,3.44 50.96,4.86 51.48,0.9 80.69,17.61 80.49,25.83 47.75,18.77 28,1.33 26.03,11.34 25.26,20.75 13.98,22.58 6.8,22.83 6.61,12.17 6.72,6.81 13.32,2.62 23.3,2.05 26.89,3.58 67.3,1.96 40.8,4.15 56.66,26.28 27.77,18.36 43.04,13.06 39.97,7.96 35.71,4.07 39.43,0.85 61.59,5.77 53.36,13.75 68.16,14.94 70.75,13.7 76.24,21.71 79.01,5.14 70.38,26.61 53.57,26.28 44.24,25.53 40.11,23.4 33.89,25.4
  pour Bottom: 0,0 81.4,0 81.4,27.5 0,27.5
  pour Top: 0,0 81.4,0 81.4,27.5 0,27.5
ID  (via drill 0.5)
  Top 0.2: U2.9 79.09,23.75
  Top 0.305: 80.28,23.75 79.09,23.75
  Top 0.406: v75.98,16.68 75.32,16.02 R9.1 | v78.37,17.7 79.43,17.7 80.43,18.7 80.62,18.89 80.62,19.75 80.62,23.41 80.28,23.75
  Bottom 0.406: 76.2,16.68 v75.98,16.68 77,17.7 v78.37,17.7
ID_N  (via drill 0.5)
  Top 0.254: 62.4,8.16 63.74,6.82 63.91,6.65 65.9,6.65 66.17,6.65 66.19,6.67 66.68,7.16 66.68,8.27 66.29,8.66 66.29,10.01 66.4,10.12 v66.4,10.55 66.33,10.48
  Top 0.305: 66.25,10.4 v66.4,10.55 | v69.51,12.41 69.74,12.18 70.34,11.58 70.34,10.07 70.62,9.79 v70.62,9.54 | 69.54,12.44 69.55,12.45 C4.1 | 62.4,8.16 62.35,8.21 60.57,8.21 60.57,8.26 60.1,8.73 56.96,8.73 U1.32
  Top 0.406: U4.1 76.08,9.41 v76.08,7.2
  Top 0.61: v69.51,12.41 69.54,12.44 Q3.3
  Bottom 0.305: v66.4,10.55 67.62,11.77 68.02,12.17 | 68.26,12.41 68.02,12.17 | v69.51,12.41 68.26,12.41 | 68.26,12.41 68.02,12.17
  Bottom 0.406: v76.08,7.2 73.98,7.2 72.96,7.2 v70.62,9.54
MIDI_IN
  Top 0.254: C26.2 34.77,12.65 34.77,12.61
  Top 0.305: 34.77,11.13 R3.1
  Top 0.406: U$24.P$8 35.71,13.77 34.77,12.83 34.77,12.61 34.77,11.13
MIDI_OUT
  Top 0.305: U$24.P$4 34.99,9.77 34.44,9.21 R17.1
N$1
  Top 1.27: 6.49,0.97 7.38,0.97
N$2
  Top 0.406: U4.3 78.06,7.53 78.06,5.88 TP2.TP
N$3
  Top 0.406: R7.1 9.38,12.81 D2.4
N$5
  Top 0.305: 11.73,8.47 U$1.18 11.3,8.47 10.1,8.47 R2.2
N$8
  Top 0.305: U$1.21 14.08,6.22 14.08,5.95 15.44,4.59 15.81,4.59 C5.2
N$9  (via drill 0.5)
  Top 0.305: R4.1 24.77,7.67 25.28,8.18 25.8,8.18 R6.2 26.16,8.53 v26.16,9.26 | v19.34,10.48 U$10.4 | v18.44,3.23 17.71,3.23 R5.2
  Bottom 0.305: v19.34,10.48 23.34,10.48 24.94,10.48 v26.16,9.26 26.16,8.21 24.21,6.26 21.47,6.26 v18.44,3.23
N$10
  Top 0.305: R6.1 C6.2
N$11
  Top 0.813: D1.A 30.13,7.65 R10.2
N$12
  Top 0.305: R12.1 5.54,15.54 D2.1
N$13
  Top 0.305: R16.1 7.85,13.34 7.85,15.25 D2.3
N$14
  Bottom 0.254: R13.2 IC1.10
N$15
  Top 0.406: U4.4 78.71,8.84 R24.2
N$16
  Top 0.406: U4.5 78.74,14.43 78.92,14.6 C3.2
N$17
  Top 0.305: R18.1 61.77,19.72 U$6.D+2
  Bottom 0.254: U$6.D+2 62.67,23.1 U$6.D+1
N$18
  Top 0.254: U$6.D-1 62.67,22.7 U$6.D-2
  Top 0.305: R19.1 62.67,19.59 U$6.D-2
N$19
  Bottom 0.254: R14.2 31.72,13.93 IC1.14
N$20
  Top 0.254: 55.28,14.39 55.53,14.64 Q2.1
  Top 0.305: U1.25 56.1,13.08 C16.2
  Top 0.61: C16.2 55.28,13.1 55.28,14.39
N$21
  Top 0.254: 58.57,14.63 U1.24 57.6,15.08 | 57.43,15.26 57.6,15.08 | 53.23,18.15 Q2.3 53.23,18.14 54.43,16.94 56.24,16.94 57.06,16.94 | 57.06,16.94 C15.2 | 57.06,16.94 57.06,15.62 57.6,15.08
  Top 0.305: 53.49,19.27 53.54,19.27 53.46,19.19 53.61,19.04 Q2.3 | 53.49,19.27 53.48,19.28 | 53.49,19.27 53.48,19.28
N$25  (via drill 0.5)
  Top 0.2: U2.1 76.52,23.2 75.75,23.2
  Top 0.254: 74.63,23.11 75.66,23.11 75.73,23.18 75.75,23.2
  Top 0.305: v68.72,24.75 69.47,25.5 71.87,25.5 72.24,25.5 74.63,23.11
  Bottom 0.305: U$6.CC1 64.24,22.93 66.87,22.93 68.14,24.2 68.3,24.36 68.5,24.56 68.52,24.56 v68.71,24.75 v68.72,24.75
N$26
  Top 0.2: U2.2 76.14,22.8 75.94,22.6 75.94,22.59
  Top 0.254: 61.62,24.53 62.71,25.62 65.68,25.62 65.68,25.57 | 74.06,22.05 74.06,22.06 | 75.94,22.59 75.92,22.57 74.57,22.57
  Top 0.305: U$6.CC2 60.87,23.78 61.62,24.53 | 74.06,22.06 74.57,22.57 | 74.06,22.05 72.86,20.85 70.4,20.85 65.84,25.41 65.68,25.57
N$27
  Top 0.2: U2.4 77.48,21.86
  Top 0.254: 77.48,21.86 77.48,20.87 R23.2
N$28
  Top 0.305: Q3.1 71.71,16.45 R8.1 72.9,16.69 R9.2
PACK_INT  (via drill 0.5)
  Top 0.406: 38.12,15.77 U$24.P$10 39.26,15.77 39.32,15.77 v39.77,16.22
  Top 0.61: 37.29,15.81 U$24.P$10 | R25.2 34.61,15.95 36.76,15.95 36.94,15.77 U$24.P$10 | C21.2 35.87,15.77 U$24.P$10
  Bottom 0.406: IC1.6 45.25,12.46 42.53,15.18 42.12,15.59 41.49,16.22 v39.77,16.22
PACK_N_RESET  (via drill 0.5)
  Top 0.305: U1.12 64.98,10.37 65,10.35 | v65.19,9.71 65.37,9.53 C8.2
  Top 0.406: U$24.P$14 37.36,19.8 37.36,19.91 | v52.46,8.79 52.29,8.96 49.54,11.71 49.54,13.79 49.54,14.63 v47.97,16.2 | v65.19,9.71 65.19,10.16 64.98,10.37 | C7.2 29.84,15.79 v29.82,15.81 | 30.01,16.57 29.82,16.38 | 41.1,19.8 v41.18,19.72
  Top 0.61: 34.83,19.77 35.39,19.77 U$24.P$14 37.33,20.01 | 34.83,19.77 33.61,19.77 | 33.61,19.77 33.21,19.77 30.01,16.57 | 29.82,16.38 v29.82,15.81 | 37.36,19.8 41.1,19.8 | R28.1 34.83,19.95 34.83,19.77 | C49.2 33.56,19.77 33.61,19.77
  Bottom 0.305: IC1.15 31.7,15.51 | v29.82,15.81 30.14,15.49
  Bottom 0.406: 31.7,15.51 30.16,15.51 30.14,15.49 | v52.46,8.79 54.03,7.22 59.85,7.22 61.8,7.22 64.23,9.65 65.13,9.65 v65.19,9.71 | v41.18,19.72 44.7,16.2 v47.97,16.2
POWER_PDO2
  Top 0.305: U$1.20 13.58,7.12 13.3,6.84 12.62,6.84 12.33,6.84 11.89,6.84 11.37,7.36 8.74,7.36 7.85,8.25 R16.2
POWER_PDO3
  Top 0.254: 11.15,11.99 R7.2
  Top 0.305: U$1.14 11.62,10.47 11.48,10.47 11.15,10.81
  Top 0.406: 11.15,11.99 11.15,10.81
RR_A  (via drill 0.5)
  Top 0.305: v73.23,12.03 C23.2
  Top 0.406: 62.87,3.13 55.84,3.13 55.1,3.13 52.78,5.45 48.55,9.68 48.55,11.23 48.55,13.94 46.81,15.68 46.36,15.68 46.27,15.77 U$24.P$9 45.78,15.62 | 62.87,3.13 63.38,3.13 | C23.2 73.23,10.76 66.1,3.63 65.6,3.13 62.87,3.13
  Bottom 0.2: RSW1.A 74.72,13.95
  Bottom 0.406: 74.72,13.95 73.23,12.46 v73.23,12.03
RR_B  (via drill 0.5)
  Top 0.305: C24.2 71.64,7.55 71.64,7.77
  Top 0.406: v73.29,9.42 71.64,7.77 66.3,2.43 63.67,2.43 63.43,2.43 55.4,2.43 54.75,2.43 52.07,5.11 52.03,5.15 47.77,9.41 47.77,10.92 47.77,12.99 46.99,13.77 46.63,13.77 U$24.P$7
  Bottom 0.305: v73.3,9.41 v73.29,9.42
  Bottom 0.406: RSW1.B v73.3,9.41 v73.29,9.42
RR_E  (via drill 0.5)
  Top 0.406: U$24.P$11 45.79,17.61 47.68,17.61 48.08,17.61 50.52,15.17 50.52,12.57 53.09,10 53.49,9.6 v54.26,9.6
  Top 0.61: C22.2 54.26,9.38 v54.26,9.6
  Bottom 0.406: v54.26,9.6 54.57,9.91 58.67,9.91 58.8,9.78 | 58.8,9.78 RSW1.SW2 | RSW1.SW2 | RSW1.SW2 58.8,9.78
RXD/I2S  (via drill 0.5)
  Top 0.305: R17.2 32.72,9.36 v32.55,9.53 | 38.45,1.99 37.05,3.38 37.05,4.86 v37.03,4.88
  Bottom 0.305: v32.55,9.53 31.82,9.53 IC1.11 33.08,9.46 U$14.TP v37.03,4.88
  Bottom 0.406: IC1.11 31.26,9.46 31.19,9.53
SCL  (via drill 0.5)
  Top 0.305: U$1.7 16.41,12.56 v16.41,14.69
  Bottom 0.305: v16.41,14.69 18.18,12.92 U$23.TP
SDA  (via drill 0.5)
  Top 0.305: U$1.8 15.08,13.8 v15.17,13.89
  Bottom 0.305: 15.59,13.17 U$22.TP 15.17,13.59 v15.17,13.89
TXD  (via drill 0.5)
  Top 0.305: v32.04,11.19 32.15,11.07 | 32.15,11.07 32.45,11.07 32.15,11.07 | v32.04,11.19 32.15,11.07 | 32.98,10.95 33.12,10.81 | R3.2 32.97,11.11 32.09,11.11 32.13,11.07 32.25,10.95 32.98,10.95 | 32.98,10.95 32.74,11.19 v32.04,11.19 | U$17.2 40.58,2.96 39.75,3.79 39.75,4.86 v39.7,4.91
  Bottom 0.305: 31.77,10.94 IC1.12 34.08,10.96 U$8.TP 39.54,5.07 v39.7,4.91 | 31.77,10.94 32.54,10.94 | 31.77,10.94 32.02,11.19 v32.04,11.19
USB_CLK  (via drill 0.5)
  Top 0.305: v59.14,12.18 v59.15,12.18 60.35,10.98 60.61,10.72 62.55,10.72 62.91,10.72 63.01,10.82 63.06,10.87 U1.13
  Bottom 0.305: IC1.3 50.08,16.96 50.52,16.96 50.89,16.59 50.85,16.55 50.85,15.4 52.26,13.99 52.26,12.92 53.49,11.69 54.56,11.69 54.81,11.69 57.84,11.69 58.38,11.69 58.87,12.18 v59.14,12.18
USB_CS  (via drill 0.5)
  Top 0.305: U1.14 v65.23,11.37 v65.24,11.36
  Bottom 0.305: IC1.7 | v65.24,11.36 64.71,11.36 61.26,7.91 60.26,7.91 54.66,7.91 54.63,7.91 53.3,9.24 52.82,9.72 51.31,9.72 50.07,10.96 IC1.7
  Bottom 0.406: 49.53,10.97 IC1.7
USB_INT/GPIO0  (via drill 0.5)
  Top 0.305: U1.18 61.57,14.87 61.85,15.15 63.96,15.15 64.47,15.15 68.07,11.55 68.75,10.87 68.75,9.91 68.75,9.55 68.75,8.24 68.75,7.88 68.75,7.66 68.43,7.34 64.91,3.82 64.69,3.82 64.33,3.82 63.02,3.82 55.4,3.82 53.98,5.24 50.92,8.3 v50.92,8.89
  Top 0.406: J3.2 45.27,1.76 42.68,4.35 42.59,4.44 v42.18,4.44 | J3.2 | J3.2 47.22,3.02 R29.2
  Bottom 0.305: 42.09,5.45 U$16.TP | IC1.8 50.38,9.46 50.92,8.92 v50.92,8.89 | v50.92,8.89 50.92,8.71 v50.92,8.89 | U$16.TP 42.04,5.18 | 41.61,5.92 41.62,5.92 U$16.TP
  Bottom 0.406: 49.5,9.42 IC1.8 | 42.51,5.28 42.29,5.5 U$16.TP 42.04,4.58 v42.18,4.44 | 42.04,5.07 41.76,4.79
  Bottom 0.61: 49.5,9.42 45.96,9.42 45.17,9.42 44.67,8.92 42.04,6.29 U$16.TP 42.04,5.07
USB_SIMO  (via drill 0.5)
  Top 0.305: v61.89,12.18 62.08,12.37 U1.16
  Bottom 0.305: IC1.5 50.16,13.96 50.5,13.96 50.9,13.56 50.9,11.47 51.65,10.72 51.82,10.55 53.57,10.55 54.34,10.55 58.73,10.55 59.33,10.55 60.06,10.55 60.12,10.55 60.35,10.55 61.1,11.3 | 60.98,11.18 61.1,11.3 | 61.1,11.3 61.89,12.09 v61.89,12.18
USB_SOMI  (via drill 0.5)
  Top 0.305: U1.15 63.09,11.87 62.5,11.28 61.67,11.28 61.42,11.28 v60.52,12.18
  Bottom 0.305: IC1.4 49.84,15.46 50.27,15.03 51.58,13.72 51.58,12.29 52.74,11.13 54.17,11.13 54.58,11.13 58.03,11.13 58.61,11.13 59.29,11.13 59.5,11.13 60.52,12.15 v60.52,12.18
VBUS  (via drill 0.5)
  Top 0.254: 15.84,21.33 16.01,21.33 16.53,21.85 16.88,22.2 U$27.V4
  Top 0.305: 22.74,20.73 22.74,20.82 22.74,20.95 22.75,20.94 | U$10.1 24.55,9.59 R4.2 24.56,9.38 | 22.75,20.94 22.85,20.94 | 21.26,10.99 21.36,10.99 | 20.59,10.96 U$10.3 20.62,10.15 18.2,7.72 U$1.24 | 21.52,22.17 21.61,22.17 | 22.75,21.03 22.75,20.94 | R2.1 9.71,10.78 v9.98,11.05
  Top 0.406: U$27.V2 21.52,22.17 | U$27.V3 17.69,23.6 17.75,23.6 18.45,24.3 18.77,24.62 18.91,24.62 | U$10.3 21.11,10.99 21.26,10.99 21.36,10.99 U$10.2 | C11.2 20.13,26.18 20.13,25.85 | 21.61,22.17 21.61,22.82 21.52,22.91 22.93,22.91 23.61,22.23
  Top 0.61: U$27.V3 U$27.V4 | U$27.V1 21.52,22.91 U$27.V2 | 18.91,24.62 20.13,25.85 22.35,25.85 22.73,25.47 | 22.74,20.73 22.68,20.67 | 23.61,24.28 23.44,24.11 | v13.57,19.72 14.23,19.72 15.84,21.33
  Top 0.813: U$10.1 U$10.2 | 22.85,12.04 21.8,10.99 21.11,10.99 | 22.73,25.47 23.61,24.59 23.61,24.28
  Top 1.016: 22.85,18.98 22.85,12.7 22.85,12.04 | 22.85,18.98 22.85,19.95 | 22.85,19.95 22.85,20.26 | 22.85,19.95 22.85,20.94 23.54,21.63 23.61,21.69 23.61,22.23 23.61,24.28 | U$5.C 23.86,17.97 22.85,18.98
  Bottom 0.305: 10,12.08 10.31,12.39 | 10.31,12.39 U$25.TP | v9.98,11.05 9.98,12.06 10.31,12.39
  Bottom 0.61: U$25.TP 10.84,16.99 v13.57,19.72
VBUS_EN_SNK  (via drill 0.5)
  Top 0.305: U$1.16 11.74,9.47 11.52,9.47 11.27,9.47 v11.14,9.61 | v14.79,3.15 14.81,3.17 R5.1
  Bottom 0.305: v11.14,9.61 14.79,5.96 v14.79,3.15
VBUS_MIDI  (via drill 0.5)
  Top 0.254: U$6.V2 65.47,21.25 65.5,21.25 | v59.57,17.12 59.57,16.78
  Top 0.305: U1.22 59.57,16.78 v59.57,17.12 59.57,17.22 59.57,17.42 C14.2 | 65.5,21.25 65.72,21.25
  Top 0.406: U4.7 77.41,15.62 77.19,15.84 77.09,15.94 | U$6.V1 U$6.V2
  Top 0.61: 66.1,20.89 65.74,21.25 65.72,21.25
  Top 0.813: 77.19,15.84 77.19,17.31 77.19,17.66 R23.1 75.03,19.81 C19.2 69.85,19.81 69.77,19.74 69.37,19.74 | 66.1,20.89 66.1,20.87 67.23,19.74 67.29,19.74 | 67.29,19.74 69.23,19.74 69.37,19.74 | C20.2 67.01,20.02 67.29,19.74 | C17.2 68.65,19.74 69.37,19.74
  Bottom 0.254: 64.36,23.6 U$6.V1 | U$6.V3 60.68,23.6 61.43,24.35 63.2,24.35 63.36,24.19 63.42,24.13 63.83,24.13 64.08,23.88 64.24,23.88 U$6.V1 | 64.52,23.66 U$6.V1 | 59.56,21.84 59.35,21.63 59.32,21.63 59.22,21.53 59.13,21.53 58.97,21.37 58.97,19.81 59.57,19.21 v59.57,17.12 | 59.86,22.2 U$6.V4
  Bottom 0.305: 59.56,21.84 U$6.V4
  Bottom 0.61: 59.86,22.2 59.92,22.26 U$6.V3
VCC  (via drill 0.5)
  Top 0.2: 77.08,23.77 U2.12
  Top 0.254: U1.2 59.07,6.3 | U1.2 59.07,5.93 | 58.94,5.8 59.07,5.93 | 59.07,5.93 U1.2 | 77.08,23.77 75.37,23.77 arc-45 75.19,23.84 v75.06,23.97 75.06,24.43 arc-45 75.13,24.61 C18.2
  Top 0.305: U1.23 59.07,13.39 59.32,13.14 63.31,13.14 63.51,12.94 64.01,12.94 64.93,12.94 65.42,12.94 v67.82,10.54 | R8.2 71.95,14.2 v71.91,14.16 71.91,14.12
  Top 0.406: C13.2 C12.2 57.4,5.63 v58.01,5.63 58.6,5.63 58.68,5.54 58.94,5.8 | 44.79,19.92 45,19.71 | 45.06,19.77 U$24.P$13
  Top 0.61: U$24.P$13 45.63,20.97 C1.1 48.28,22.05 C2.1 48.29,21.19 v48.04,20.94 48.41,20.57 48.38,20.57 R1.2 | 44.79,19.92 44.79,20.44 43.91,21.32 43.71,21.52 43.51,21.72 R28.2 | 44.77,5.42 v44.71,5.36 45.52,4.55 R29.1
  Top 0.813: 41.58,7.63 41.58,8.53 41.58,16.64 41.58,17.32 41.58,17.86 43.34,19.62 43.43,19.71 44.87,19.71 44.93,19.77 U$24.P$13 | 41.58,7.63 41.58,7.57 | 45,19.71 45.06,19.77 | 41.58,7.63 43.12,6.09 43.85,5.36 44.41,5.36 | 44.41,5.36 v44.71,5.36 44.41,5.36
  Bottom 0.305: 73.24,16.24 73.24,16.27 | 73.24,14.33 73.24,13.99 | 68.38,9.85 68.38,9.76 | 68.38,9.76 68.38,8.9 | v67.82,10.54 68.38,9.98 68.38,9.76 | v71.91,14.16 72.34,13.73 72.34,12.86
  Bottom 0.406: U$19.TP 44.6,5.5
  Bottom 0.61: v48.04,20.94 49.02,19.96 IC1.1
  Bottom 0.813: 73.24,15.41 73.24,16.24 | 73.24,16.24 73.24,16.27 | 73.24,16.27 73.24,16.57 | 73.24,16.57 73.24,17.89 73.24,18.26 75.06,20.08 v75.06,23.97 | 73.24,16.24 73.24,15.33 73.24,14.33 73.24,13.99 73.24,13.76 72.34,12.86 68.82,9.34 68.38,8.9 66.6,7.12 66.05,7.12 65.52,7.12 64.82,7.12 61.33,3.63 58.4,3.63 57.31,3.63 | 73.24,16.24 73.24,16.27 | 73.24,16.27 73.24,16.57 | 57.31,3.63 53.49,3.63 48.29,3.63 48.08,3.63 46.44,3.63 v44.71,5.36 44.68,5.36 U$19.TP | v58.01,5.63 58.01,4.33 57.31,3.63
VDD
  Top 0.305: C25.2 74.68,2.5 74.61,2.5
  Top 0.406: U4.2 77.41,8.71 77.41,7 74.61,4.21 | U4.8 76.73,14.36 76.07,14.36 | 74.61,5.91 74.61,5.38
  Top 0.813: 45.49,7.63 U$24.P$1 | U$24.P$1 45.63,7.7 46.13,7.7 46.78,7.7 | 46.49,7.77 U$24.P$1 | U$24.P$1 46.37,7.77 47.51,6.63 53.49,0.65 53.61,0.65 53.83,0.65 55.07,0.65 55.68,0.65 72.95,0.65 74.61,2.31 74.61,2.5 74.61,4.21 74.61,5.38 74.61,7.73 74.61,12.9 76.07,14.36
  Top 1.016: U$24.P$3 45.63,8.2 46.13,7.7
VREG_2V7
  Top 0.305: U$1.23 15.08,7.15 15.08,6.68 15.45,6.31 15.96,6.31 C9.2
VSNK  (via drill 0.5)
  Top 0.305: C6.1 23.73,5.18 U$10.8 | J1.1 4.2,3.11 4.11,3.11 | 6.79,15.56 6.79,17.47 R11.1
  Top 0.406: D2.2 6.79,15.56 | 21.88,3.25 v20.38,1.75
  Top 0.61: U$10.8 U$10.7 U$10.6 U$10.5 | D2.2 6.83,14.34 4.65,12.15 4.11,11.61 4.11,3.11 | 7.53,0.97 6.28,0.97 6.25,0.97
  Top 1.27: 21.88,3.25 U$10.7 | U$12.C v20.38,1.75 | v20.38,1.75 20.37,1.73 | 20.37,1.73 19.62,0.98 7.34,0.98 | v20.38,1.75 20.37,1.73 | 7.53,0.97 6.28,0.97 6.28,1.02 J1.1
  Bottom 1.27: v20.38,1.75 20.34,1.75 19.57,0.98 6.34,0.98 6.27,0.98 6.27,1.03 J1.1

### Text on the board
tPlace: USB-C MIDI | USB-C POWER | YXC | Designed and Made / in TAIPEI, TAIWAN | + | DEBUG | MIDI | TEVOFY TECH. LTD. / Muro Box Add-on Pack / V0.4, 2020 | 15V OUT
bPlace: * | C D G V | V 0 T R G D